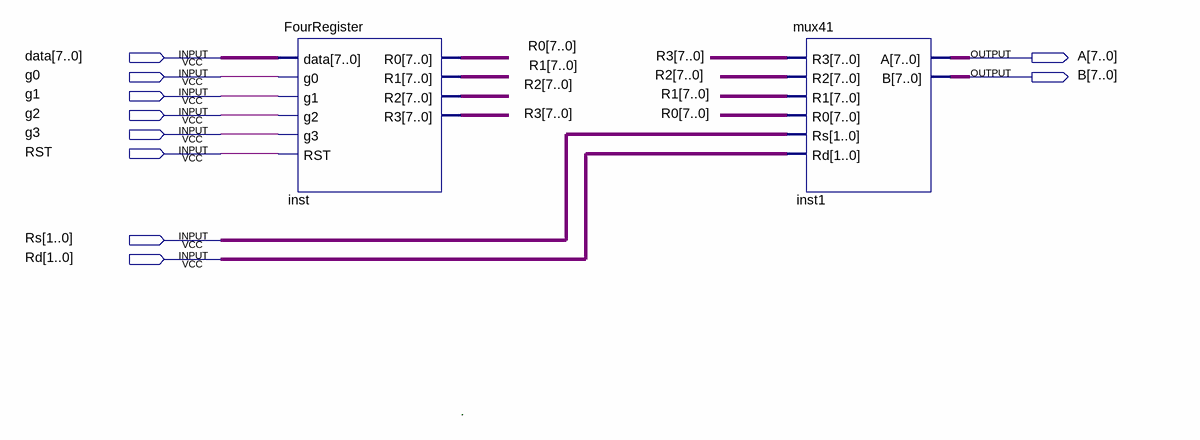
[diagram p0: schematic sheet]
// Quartus schematic GeneralPurposeRegister.bdf as structural Verilog: 2 symbols, 10 pins
module GeneralPurposeRegister (
  input  [7:0] data,
  input  g0,
  input  g1,
  input  g2,
  input  g3,
  input  RST,
  input  [1:0] Rs,
  input  [1:0] Rd,
  output [7:0] A,
  output [7:0] B
);

  wire [7:0] R0, R1, R2, R3;

  FourRegister inst (.data(data), .g0(g0), .g1(g1), .g2(g2), .g3(g3), .RST(RST), .R0(R0), .R1(R1), .R2(R2), .R3(R3));
  mux41 inst1 (.R3(R3), .R2(R2), .R1(R1), .R0(R0), .Rs(Rs), .Rd(Rd), .A(A), .B(B));

  // Notes on the sheet:
  //   .
endmodule
